# EAGLE design controller_left_bottom (EAGLE 7.6.0)
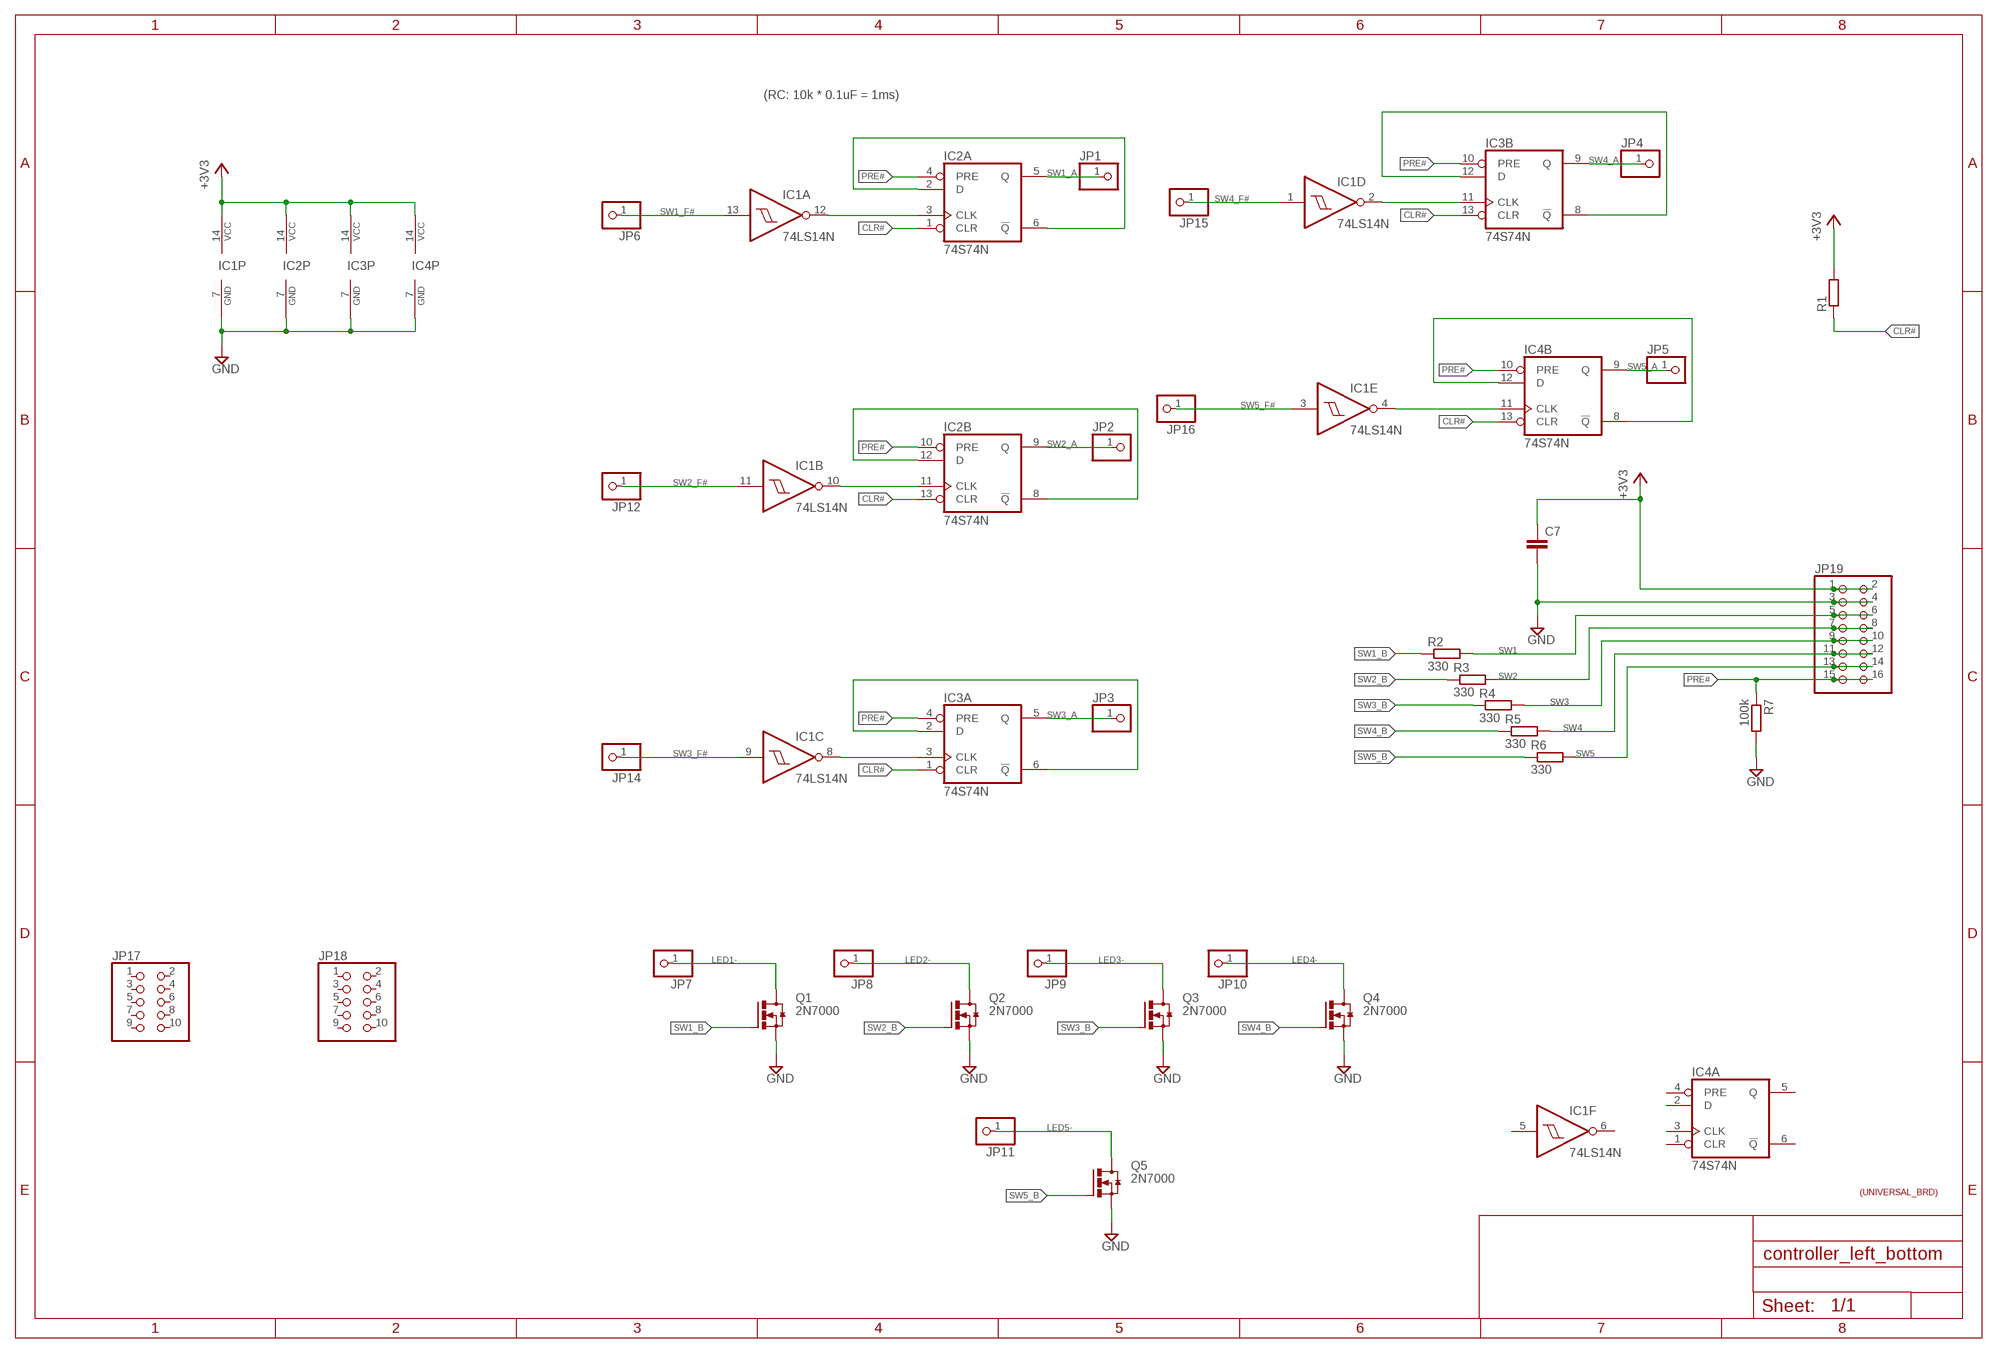
[diagram p0: schematic, sheet 1]

## Parts
C7  C_DIP_2.54_1  [C_DIP2.54_1]
IC1  74LS14N  [DIL14]
IC2  74S74N  [DIL14]
IC3  74S74N  [DIL14]
IC4  74S74N  [DIL14]
JP1  PINHD-1X1  [1X01_UNIVERSAL_BRD]
JP2  PINHD-1X1  [1X01_UNIVERSAL_BRD]
JP3  PINHD-1X1  [1X01_UNIVERSAL_BRD]
JP4  PINHD-1X1  [1X01_UNIVERSAL_BRD]
JP5  PINHD-1X1  [1X01_UNIVERSAL_BRD]
JP6  PINHD-1X1  [1X01_UNIVERSAL_BRD]
JP7  PINHD-1X1  [1X01_UNIVERSAL_BRD]
JP8  PINHD-1X1  [1X01_UNIVERSAL_BRD]
JP9  PINHD-1X1  [1X01_UNIVERSAL_BRD]
JP10  PINHD-1X1  [1X01_UNIVERSAL_BRD]
JP11  PINHD-1X1  [1X01_UNIVERSAL_BRD]
JP12  PINHD-1X1  [1X01_UNIVERSAL_BRD]
JP14  PINHD-1X1  [1X01_UNIVERSAL_BRD]
JP15  PINHD-1X1  [1X01_UNIVERSAL_BRD]
JP16  PINHD-1X1  [1X01_UNIVERSAL_BRD]
JP17  PINHD-2X5  [2X05]
JP18  PINHD-2X5  [2X05]
JP19  PINHD-2X8  [2X08]
Q1  2N7000  [TO92]
Q2  2N7000  [TO92]
Q3  2N7000  [TO92]
Q4  2N7000  [TO92]
Q5  2N7000  [TO92]
R1  R_DIP_4  [R_DIP2.54_4]
R2  330  R_DIP_4  [R_DIP2.54_4]
R3  330  R_DIP_4  [R_DIP2.54_4]
R4  330  R_DIP_4  [R_DIP2.54_4]
R5  330  R_DIP_4  [R_DIP2.54_4]
R6  330  R_DIP_4  [R_DIP2.54_4]
R7  100k  R_DIP_4  [R_DIP2.54_4]
U$1  UNIVERSAL_BRD_95MM_72MM  [UNIVERSAL_BRD_95MM_72MM]

## Nets
+3V3: C7.1 IC1.14(P:VCC) IC2.14(P:VCC) IC3.14(P:VCC) IC4.14(P:VCC) JP19.1 JP19.2 R1.2
CLR#: IC2.1(A:CLR) IC2.13(B:CLR) IC3.1(A:CLR) IC3.13(B:CLR) IC4.13(B:CLR) R1.1
GND: C7.2 IC1.7(P:GND) IC2.7(P:GND) IC3.7(P:GND) IC4.7(P:GND) JP19.3 JP19.4 Q1.S Q2.S Q3.S Q4.S Q5.S R7.2
LED1-: JP7.1 Q1.D
LED2-: JP8.1 Q2.D
LED3-: JP9.1 Q3.D
LED4-: JP10.1 Q4.D
LED5-: JP11.1 Q5.D
N$1: IC2.2(A:D) IC2.6(A:!Q)
N$2: IC4.8(B:!Q) IC4.12(B:D)
N$3: IC3.2(A:D) IC3.6(A:!Q)
N$4: IC1.4(E:O) IC4.11(B:CLK)
N$5: IC2.8(B:!Q) IC2.12(B:D)
N$6: IC1.12(A:O) IC2.3(A:CLK)
N$10: IC1.10(B:O) IC2.11(B:CLK)
N$14: IC1.8(C:O) IC3.3(A:CLK)
N$15: IC3.8(B:!Q) IC3.12(B:D)
N$18: IC1.2(D:O) IC3.11(B:CLK)
PRE#: IC2.4(A:PRE) IC2.10(B:PRE) IC3.4(A:PRE) IC3.10(B:PRE) IC4.10(B:PRE) JP19.15 JP19.16 R7.1
SW1: JP19.5 JP19.6 R2.2
SW1_A: IC2.5(A:Q) JP1.1
SW1_B: Q1.G R2.1
SW1_F#: IC1.13(A:I) JP6.1
SW2: JP19.7 JP19.8 R3.2
SW2_A: IC2.9(B:Q) JP2.1
SW2_B: Q2.G R3.1
SW2_F#: IC1.11(B:I) JP12.1
SW3: JP19.9 JP19.10 R4.2
SW3_A: IC3.5(A:Q) JP3.1
SW3_B: Q3.G R4.1
SW3_F#: IC1.9(C:I) JP14.1
SW4: JP19.11 JP19.12 R5.2
SW4_A: IC3.9(B:Q) JP4.1
SW4_B: Q4.G R5.1
SW4_F#: IC1.1(D:I) JP15.1
SW5: JP19.13 JP19.14 R6.2
SW5_A: IC4.9(B:Q) JP5.1
SW5_B: Q5.G R6.1
SW5_F#: IC1.3(E:I) JP16.1
Unconnected: IC1.5(F:I) IC1.6(F:O) IC4.1(A:CLR) IC4.2(A:D) IC4.3(A:CLK) IC4.4(A:PRE) IC4.5(A:Q) IC4.6(A:!Q) JP17.1 JP17.2 JP17.3 JP17.4 JP17.5 JP17.6 JP17.7 JP17.8 JP17.9 JP17.10 JP18.1 JP18.2 JP18.3 JP18.4 JP18.5 JP18.6 JP18.7 JP18.8 JP18.9 JP18.10

## Notes on the sheet
- (RC: 10k * 0.1uF = 1ms)

## Library data of the parts
C7 = shozaburo_rcl:C: s means small package
IC1 = shozaburo_74xx-us:74*14: Hex schmitt trigger INVERTER
IC2-IC4 = shozaburo_74xx-us:74*74: Dual D type positive edge triggered FLIP FLOP, preset and clear
JP1-JP12 JP14-JP16 = shozaburo_pinhead:PINHD-1X1: PIN HEADER
JP17 JP18 = shozaburo_pinhead:PINHD-2X5: PIN HEADER
JP19 = shozaburo_pinhead:PINHD-2X8: PIN HEADER
Q1-Q5 = shozaburo_mosfet:2N7000
R1-R7 = shozaburo_rcl:R
U$1 = shozaburo_brd_template:UNIVERSAL_BRD_95MM_72MM

## Board
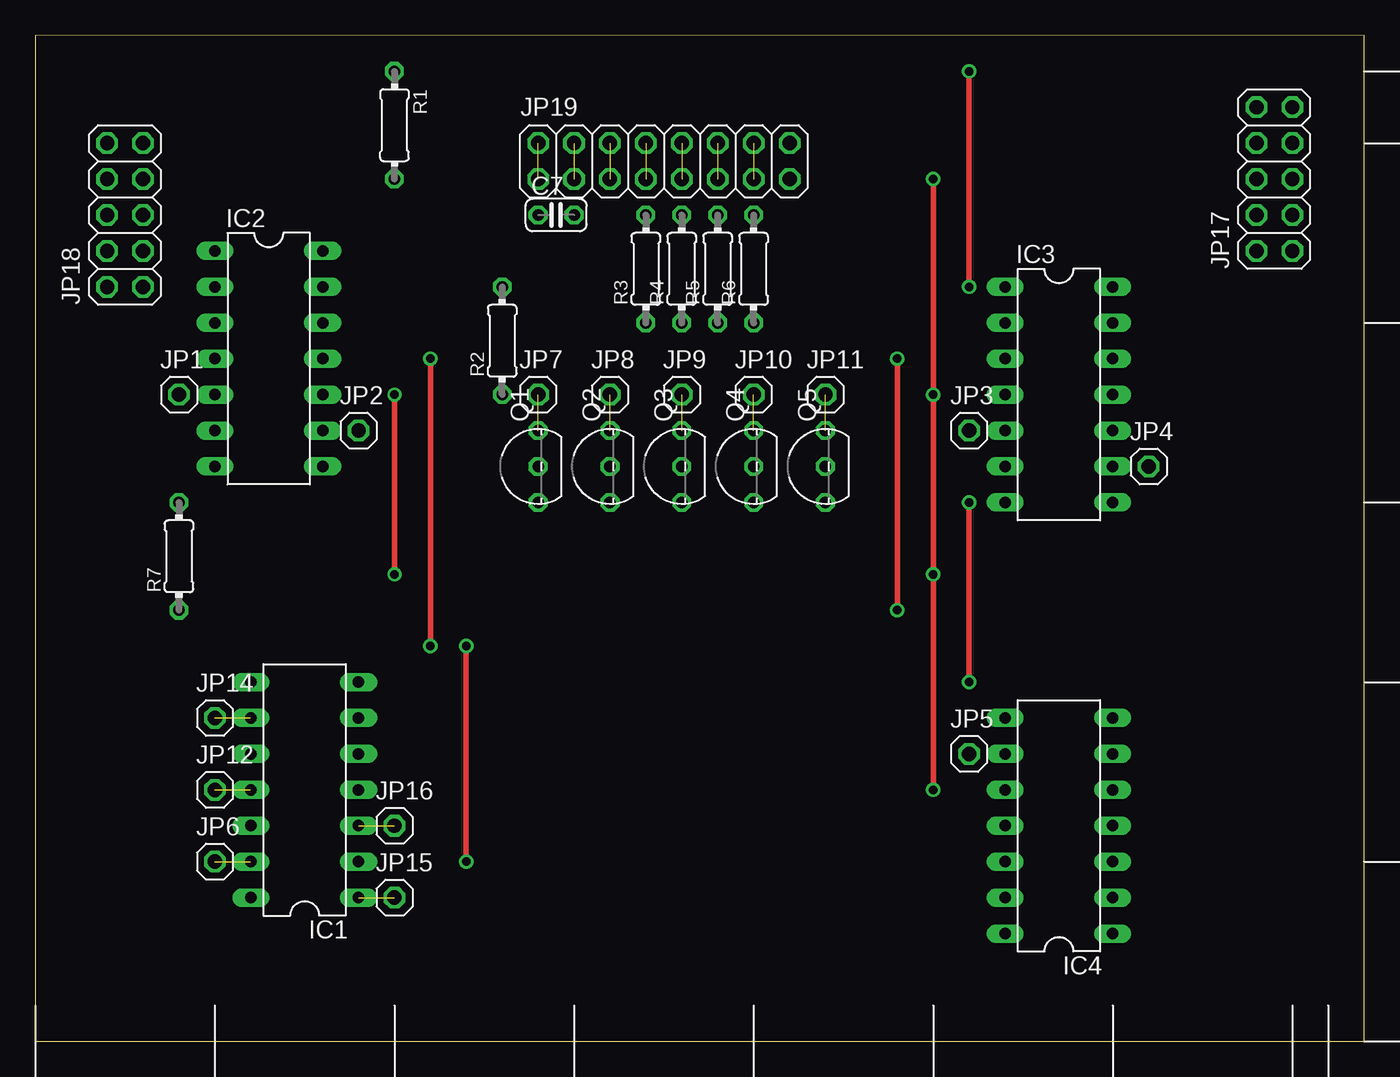
[diagram p1: board, top side]
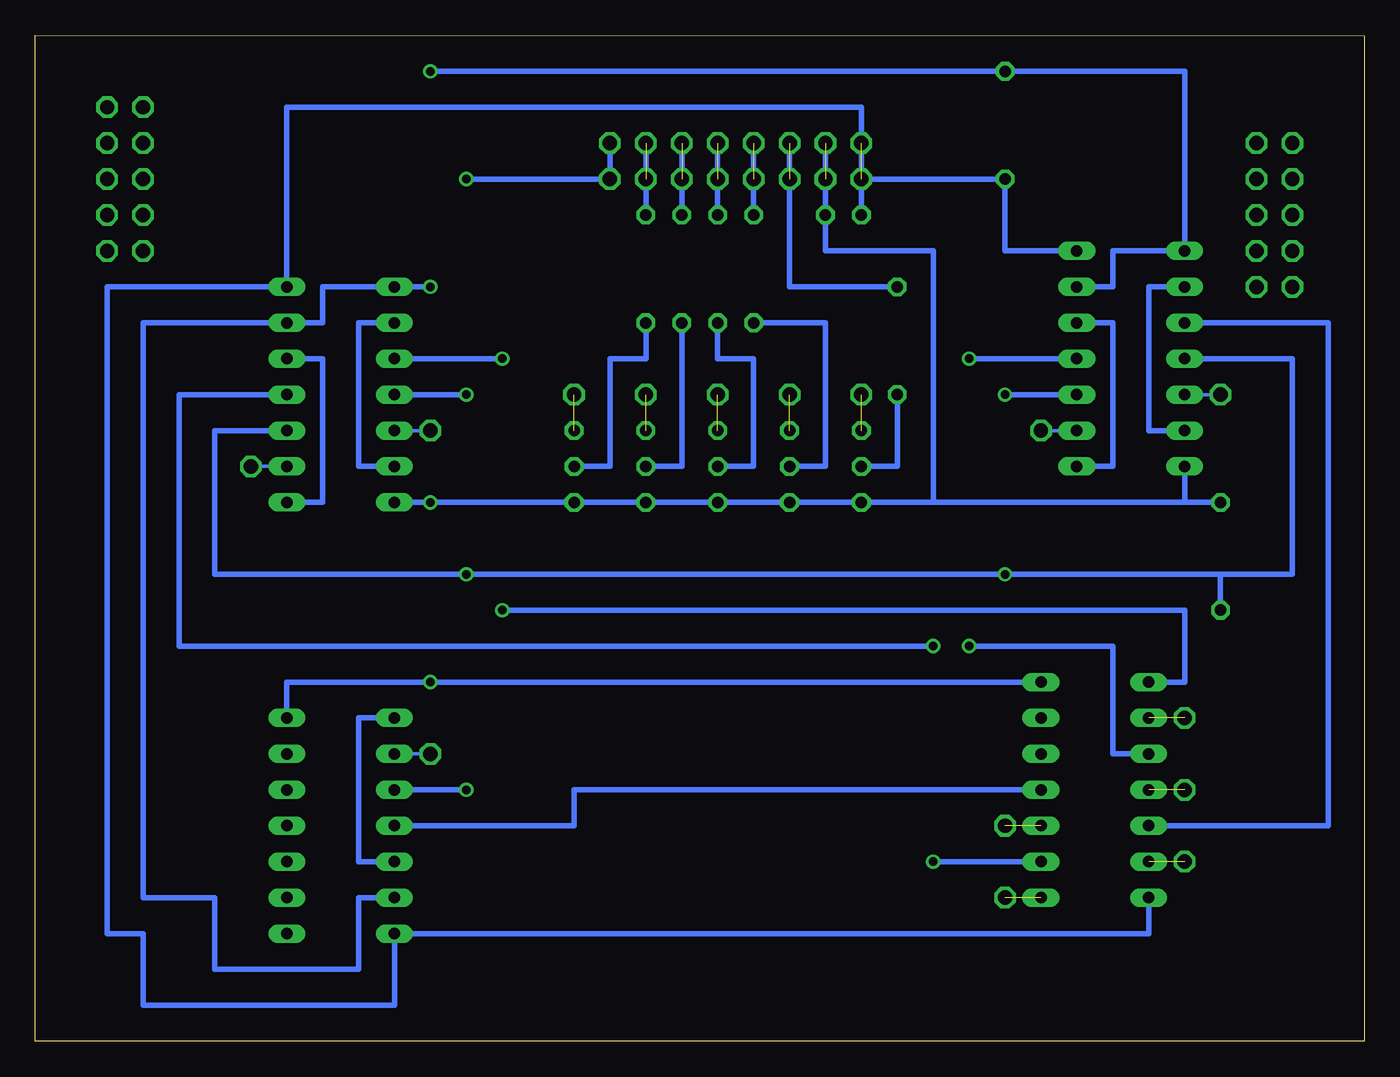
[diagram p2: board, bottom side, seen from below]

Size 93.98 x 71.12 mm. Coordinates in mm from the lower left corner, seen from the top.
Outline: 0,0 93.98,0 93.98,71.12 0,71.11 0,0
Copper layers (1*16): Top 0.035mm / dielectric 1.5mm / Bottom 0.035mm
Design rules "default": minimum track width 10mil, minimum drill 24mil, track to track 8mil, track to pad 8mil, pad to pad 8mil, via to via 8mil, smd to smd 8mil, copper to edge 40mil, drill to drill 8mil, minimum pad ring 10mil, minimum via ring 8mil, stop-mask expansion 4mil, vias tented up to drill 0mil, thermal gap 10mil

### Footprints (pad centres in the part's own frame; a part is rotated, then mirrored left to right if it is on the bottom)
C_DIP2.54_1 = drill 0.813 octagon: 1 -1.27,0; 2 1.27,0
DIL14 = drill 0.813 long: 1 -7.62,-2.54; 2 -5.08,-2.54; 3 -2.54,-2.54; 4 0,-2.54; 5 2.54,-2.54; 6 5.08,-2.54; 7 7.62,-2.54; 8 7.62,5.08; 9 5.08,5.08; 10 2.54,5.08; 11 0,5.08; 12 -2.54,5.08; 13 -5.08,5.08; 14 -7.62,5.08
1X01_UNIVERSAL_BRD = drill 1.016 octagon: 1 0,0
2X05 = drill 1.016 octagon: 1 -5.08,-1.27; 2 -5.08,1.27; 3 -2.54,-1.27; 4 -2.54,1.27; 5 0,-1.27; 6 0,1.27; 7 2.54,-1.27; 8 2.54,1.27; 9 5.08,-1.27; 10 5.08,1.27
2X08 = drill 1.016 octagon: 1 -8.89,-1.27; 2 -8.89,1.27; 3 -6.35,-1.27; 4 -6.35,1.27; 5 -3.81,-1.27; 6 -3.81,1.27; 7 -1.27,-1.27; 8 -1.27,1.27; 9 1.27,-1.27; 10 1.27,1.27; 11 3.81,-1.27; 12 3.81,1.27; 13 6.35,-1.27; 14 6.35,1.27; 15 8.89,-1.27; 16 8.89,1.27
TO92 = drill 0.813 octagon: D 2.54,0; G 0,0; S -2.54,0
R_DIP2.54_4 = drill 0.813 octagon: 1 -3.81,0; 2 3.81,0

### Placement (x,y rotation side)
C7  36.83,58.42 0 top
IC1  20.32,17.78 90 top
IC2  15.24,48.26 270 top
IC3  71.12,45.72 270 top
IC4  73.66,15.24 90 top
JP1  10.16,45.72 0 top
JP2  22.86,43.18 0 top
JP3  66.04,43.18 0 top
JP4  78.74,40.64 0 top
JP5  66.04,20.32 0 top
JP6  12.7,12.7 0 top
JP7  35.56,45.72 0 top
JP8  40.64,45.72 0 top
JP9  45.72,45.72 0 top
JP10  50.8,45.72 0 top
JP11  55.88,45.72 0 top
JP12  12.7,17.78 0 top
JP14  12.7,22.86 0 top
JP15  25.4,10.16 0 top
JP16  25.4,15.24 0 top
JP17  87.63,60.96 90 top
JP18  6.35,58.42 90 top
JP19  44.45,62.23 0 top
Q1  35.56,40.64 90 top
Q2  40.64,40.64 90 top
Q3  45.72,40.64 90 top
Q4  50.8,40.64 90 top
Q5  55.88,40.64 90 top
R1  25.4,64.77 270 top
R2  33.02,49.53 90 top
R3  43.18,54.61 90 top
R4  45.72,54.61 90 top
R5  48.26,54.61 90 top
R6  50.8,54.61 90 top
R7  10.16,34.29 90 top
U$1  0,0 0 top

### Tracks (layer width: path | path; a pad name or v marks a point on that pad's centre or on a via)
+3V3  (1 unrouted)
  Bottom 0.406: IC1.14 15.24,7.62 IC4.14 68.58,2.54 86.36,2.54 86.36,7.62 88.9,7.62 88.9,53.34 IC3.14 76.2,66.04 35.56,66.04 JP19.1 | 21.59,55.88 IC2.14 25.4,55.88 R1.2 JP19.1 | C7.1 JP19.1
CLR#  (via drill 0.6)
  Top 0.406: v66.04,68.58 v66.04,53.34
  Bottom 0.406: IC2.13 17.78,53.34 17.78,55.88 IC2.1 12.7,68.58 R1.1 v66.04,68.58 | v66.04,53.34 IC3.1 73.66,53.34 73.66,50.8 IC3.13 86.36,50.8 86.36,10.16 81.28,10.16 81.28,5.08 71.12,5.08 71.12,10.16 IC4.13
GND  (via drill 0.6)  (1 unrouted)
  Top 0.406: v66.04,38.1 v66.04,25.4
  Bottom 0.406: IC3.7 v66.04,38.1 Q5.S Q4.S Q3.S Q2.S Q1.S 30.48,38.1 | IC2.7 12.7,38.1 | IC1.7 v66.04,25.4 76.2,25.4 IC4.7 | 30.48,38.1 30.48,55.88 38.1,55.88 C7.2 JP19.4 | 30.48,38.1 12.7,38.1 | R7.2 12.7,38.1
LED1-  (1 unrouted)
LED2-  (1 unrouted)
LED3-  (1 unrouted)
LED4-  (1 unrouted)
LED5-  (1 unrouted)
N$1
  Bottom 0.406: IC2.2 15.24,53.34 15.24,43.18 IC2.6
N$2
  Bottom 0.406: IC4.8 71.12,22.86 71.12,12.7 IC4.12
N$3
  Bottom 0.406: IC3.2 71.12,50.8 71.12,40.64 IC3.6
N$4
  Bottom 0.406: IC1.4 55.88,17.78 55.88,15.24 IC4.11
N$5
  Bottom 0.406: IC2.8 17.78,40.64 17.78,50.8 IC2.12
N$6
  Bottom 0.406: IC2.3 2.54,50.8 2.54,15.24 IC1.12
N$10  (via drill 0.6)
  Top 0.406: v27.94,48.26 v27.94,27.94
  Bottom 0.406: IC2.11 v27.94,48.26 | IC1.10 17.78,20.32 17.78,27.94 v27.94,27.94
N$14  (via drill 0.6)
  Top 0.406: v60.96,48.26 v60.96,30.48
  Bottom 0.406: IC1.8 12.7,25.4 12.7,30.48 v60.96,30.48 | IC3.3 v60.96,48.26
N$15
  Bottom 0.406: IC3.12 73.66,48.26 73.66,38.1 IC3.8
N$18  (via drill 0.6)
  Top 0.406: v30.48,27.94 v30.48,12.7
  Bottom 0.406: IC3.11 83.82,45.72 83.82,27.94 v30.48,27.94 | IC1.2 v30.48,12.7
PRE#  (via drill 0.6)
  Top 0.406: v25.4,45.72 v25.4,33.02 | v63.5,60.96 v63.5,45.72 v63.5,33.02 v63.5,17.78
  Bottom 0.406: IC3.4 v63.5,45.72 | IC3.10 81.28,43.18 81.28,33.02 v63.5,33.02 v25.4,33.02 10.16,33.02 | 10.16,33.02 5.08,33.02 5.08,48.26 IC2.4 | IC2.10 v25.4,45.72 | v63.5,17.78 IC4.10 | R7.1 10.16,33.02 | JP19.16 JP19.15 v63.5,60.96
SW1  (1 unrouted)
  Bottom 0.406: R2.2 40.64,53.34 JP19.6
SW1_A
  Bottom 0.254: JP1.1 IC2.5
SW1_B
  Bottom 0.406: R2.1 33.02,40.64 Q1.G
SW1_F#  (1 unrouted)
SW2  (1 unrouted)
  Bottom 0.406: R3.2 JP19.8
SW2_A
  Bottom 0.254: JP2.1 IC2.9
SW2_B
  Bottom 0.406: R3.1 38.1,50.8 38.1,40.64 Q2.G
SW2_F#  (1 unrouted)
SW3  (1 unrouted)
  Bottom 0.406: JP19.10 R4.2
SW3_A
  Bottom 0.254: JP3.1 IC3.5
SW3_B
  Bottom 0.406: R4.1 45.72,48.26 43.18,48.26 43.18,40.64 Q3.G
SW3_F#  (1 unrouted)
SW4  (1 unrouted)
  Bottom 0.406: JP19.12 R5.2
SW4_A
  Bottom 0.254: JP4.1 IC3.9
SW4_B
  Bottom 0.406: R5.1 48.26,40.64 Q4.G
SW4_F#  (1 unrouted)
SW5  (1 unrouted)
  Bottom 0.406: JP19.14 R6.2
SW5_A
  Bottom 0.254: JP5.1 IC4.9
SW5_B
  Bottom 0.406: R6.1 50.8,48.26 53.34,48.26 53.34,40.64 Q5.G
SW5_F#  (1 unrouted)